# EAGLE design Rocket (EAGLE 9.6.2)

## Sheet 1 of 3
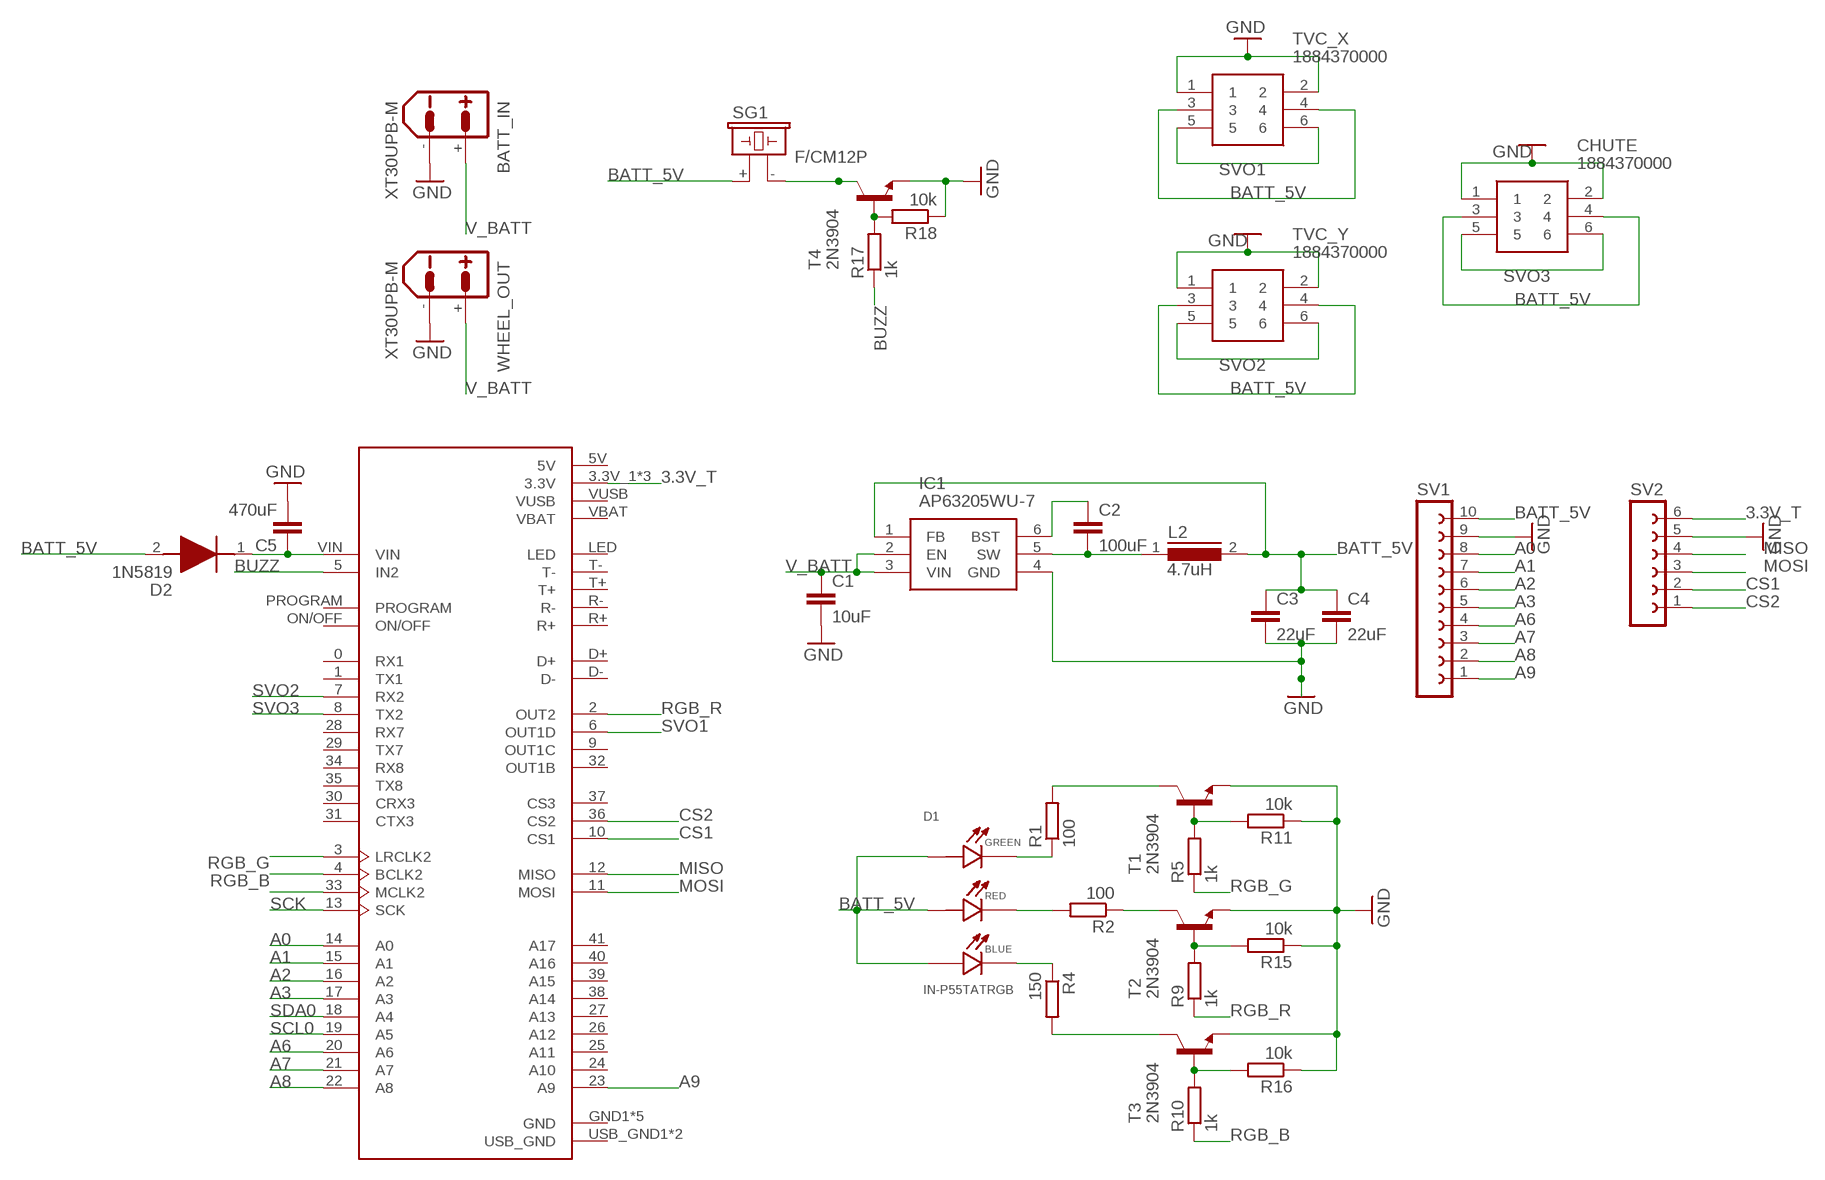
[diagram p0: schematic, sheet 1]

### Parts
BATT_IN  XT30UPB-M  [XT30UPB-M]
C1  10uF  C2.5/2  [C2.5-2]
C2  100uF  C2.5/2  [C2.5-2]
C3  22uF  C2.5/2  [C2.5-2]
C4  22uF  C2.5/2  [C2.5-2]
C5  470uF  C2.5/2  [C2.5-2]
CHUTE  1884370000  [1884370000]
D1  IN-P55TATRGB  [LED_IN-P55TATRGB]
D2  1N5819  [DIOAD1414W86L464D238]
IC1  AP63205WU-7  [AP63205WU7]
L2  4.7uH  MCC10  [MCC10]
R1  100  R-EU_0204/7  [0204/7]
R2  100  R-EU_0204/7  [0204/7]
R4  150  R-EU_0204/7  [0204/7]
R5  1k  R-EU_0204/7  [0204/7]
R9  1k  R-EU_0204/7  [0204/7]
R10  1k  R-EU_0204/7  [0204/7]
R11  10k  R-EU_0204/7  [0204/7]
R15  10k  R-EU_0204/7  [0204/7]
R16  10k  R-EU_0204/7  [0204/7]
R17  1k  R-EU_0204/7  [0204/7]
R18  10k  R-EU_0204/7  [0204/7]
SG1  F/CM12P  [F/CM12P]
SV1  FE10-1  [FE10]
SV2  FE06-1  [FE06]
T1  2N3904  [TO92]
T2  2N3904  [TO92]
T3  2N3904  [TO92]
T4  2N3904  [TO92]
TVC_X  1884370000  [1884370000]
TVC_Y  1884370000  [1884370000]
U6  DEV-16771  [MODULE_DEV-16771]
WHEEL_OUT  XT30UPB-M  [XT30UPB-M]

### Nets
3.3V_T: SV2.6 U6.3.3V_1(3.3V) U6.3.3V_2(3.3V) U6.3.3V_3(3.3V) ; also sheet 2,3
A0 [Info]: SV1.8 U6.14(A0)
A1 [Info]: SV1.7 U6.15(A1)
A2 [Info]: SV1.6 U6.16(A2)
A3 [Info]: SV1.5 U6.17(A3)
A6 [Info]: SV1.4 U6.20(A6)
A7 [Info]: SV1.3 U6.21(A7)
A8 [Info]: SV1.2 U6.22(A8)
A9 [Info]: SV1.1 U6.23(A9)
BATT_5V: C3.1 C4.1 CHUTE.3 CHUTE.4 D1.4(G_A) D1.5(R_A) D1.6(B_A) D2.2(A) IC1.1(FB) L2.2 SG1.+ SV1.10 TVC_X.3 TVC_X.4 TVC_Y.3 TVC_Y.4
BUZZ [Info]: R17.1 U6.5(IN2)
CS1 [Info]: SV2.2 U6.10(CS1)
CS2 [Info]: SV2.1 U6.36(CS2)
GND: BATT_IN.- C1.2 C3.2 C4.2 C5.2 CHUTE.1 CHUTE.2 IC1.4(GND) R11.1 R15.1 R16.1 R18.1 SV1.9 SV2.5 T1.3(E) T2.3(E) T3.3(E) T4.3(E) TVC_X.1 TVC_X.2 TVC_Y.1 TVC_Y.2 WHEEL_OUT.- ; also sheet 2,3
MISO [Info]: SV2.4 U6.12(MISO)
MOSI [Info]: SV2.3 U6.11(MOSI)
N$1 [Info]: D1.3(G_C) R1.1
N$2 [Info]: U6.33(MCLK2)
N$3 [Info]: D1.2(R_C) R2.2
N$4: C5.1 D2.1(K) U6.VIN
N$5 [Info]: D1.1(B_C) R4.1
N$6 [Info]: R1.2 T1.1(C)
N$7: C2.2 IC1.5(SW) L2.1
N$8: C2.1 IC1.6(BST)
N$11 [Info]: R2.1 T2.1(C)
N$12 [Info]: R4.2 T3.1(C)
N$13 [Info]: R5.2 R11.2 T1.2(B)
N$14 [Info]: R9.2 R15.2 T2.2(B)
N$15 [Info]: R10.2 R16.2 T3.2(B)
N$16 [Info]: SG1.- T4.1(C)
N$17 [Info]: R17.2 R18.2 T4.2(B)
RGB_B [Info]: R10.1 U6.4(BCLK2)
RGB_G [Info]: R5.1 U6.3(LRCLK2)
RGB_R [Info]: R9.1 U6.2(OUT2)
SCK [Info]: U6.13(SCK)
SCL0 [Info]: U6.19(A5) ; also sheet 2,3
SDA0 [Info]: U6.18(A4) ; also sheet 2,3
SVO1 [Info]: TVC_X.5 TVC_X.6 U6.6(OUT1D)
SVO2 [Info]: TVC_Y.5 TVC_Y.6 U6.7(RX2)
SVO3 [Info]: CHUTE.5 CHUTE.6 U6.8(TX2)
V_BATT: BATT_IN.+ C1.1 IC1.2(EN) IC1.3(VIN) WHEEL_OUT.+
Unconnected: U6.0(RX1) U6.1(TX1) U6.9(OUT1C) U6.24(A10) U6.25(A11) U6.26(A12) U6.27(A13) U6.28(RX7) U6.29(TX7) U6.30(CRX3) U6.31(CTX3) U6.32(OUT1B) U6.34(RX8) U6.35(TX8) U6.37(CS3) U6.38(A14) U6.39(A15) U6.40(A16) U6.41(A17) U6.D+ U6.D- U6.LED U6.ON/OFF U6.PROGRAM U6.R+ U6.R- U6.T+ U6.T- U6.VBAT U6.VUSB

## Sheet 2 of 3
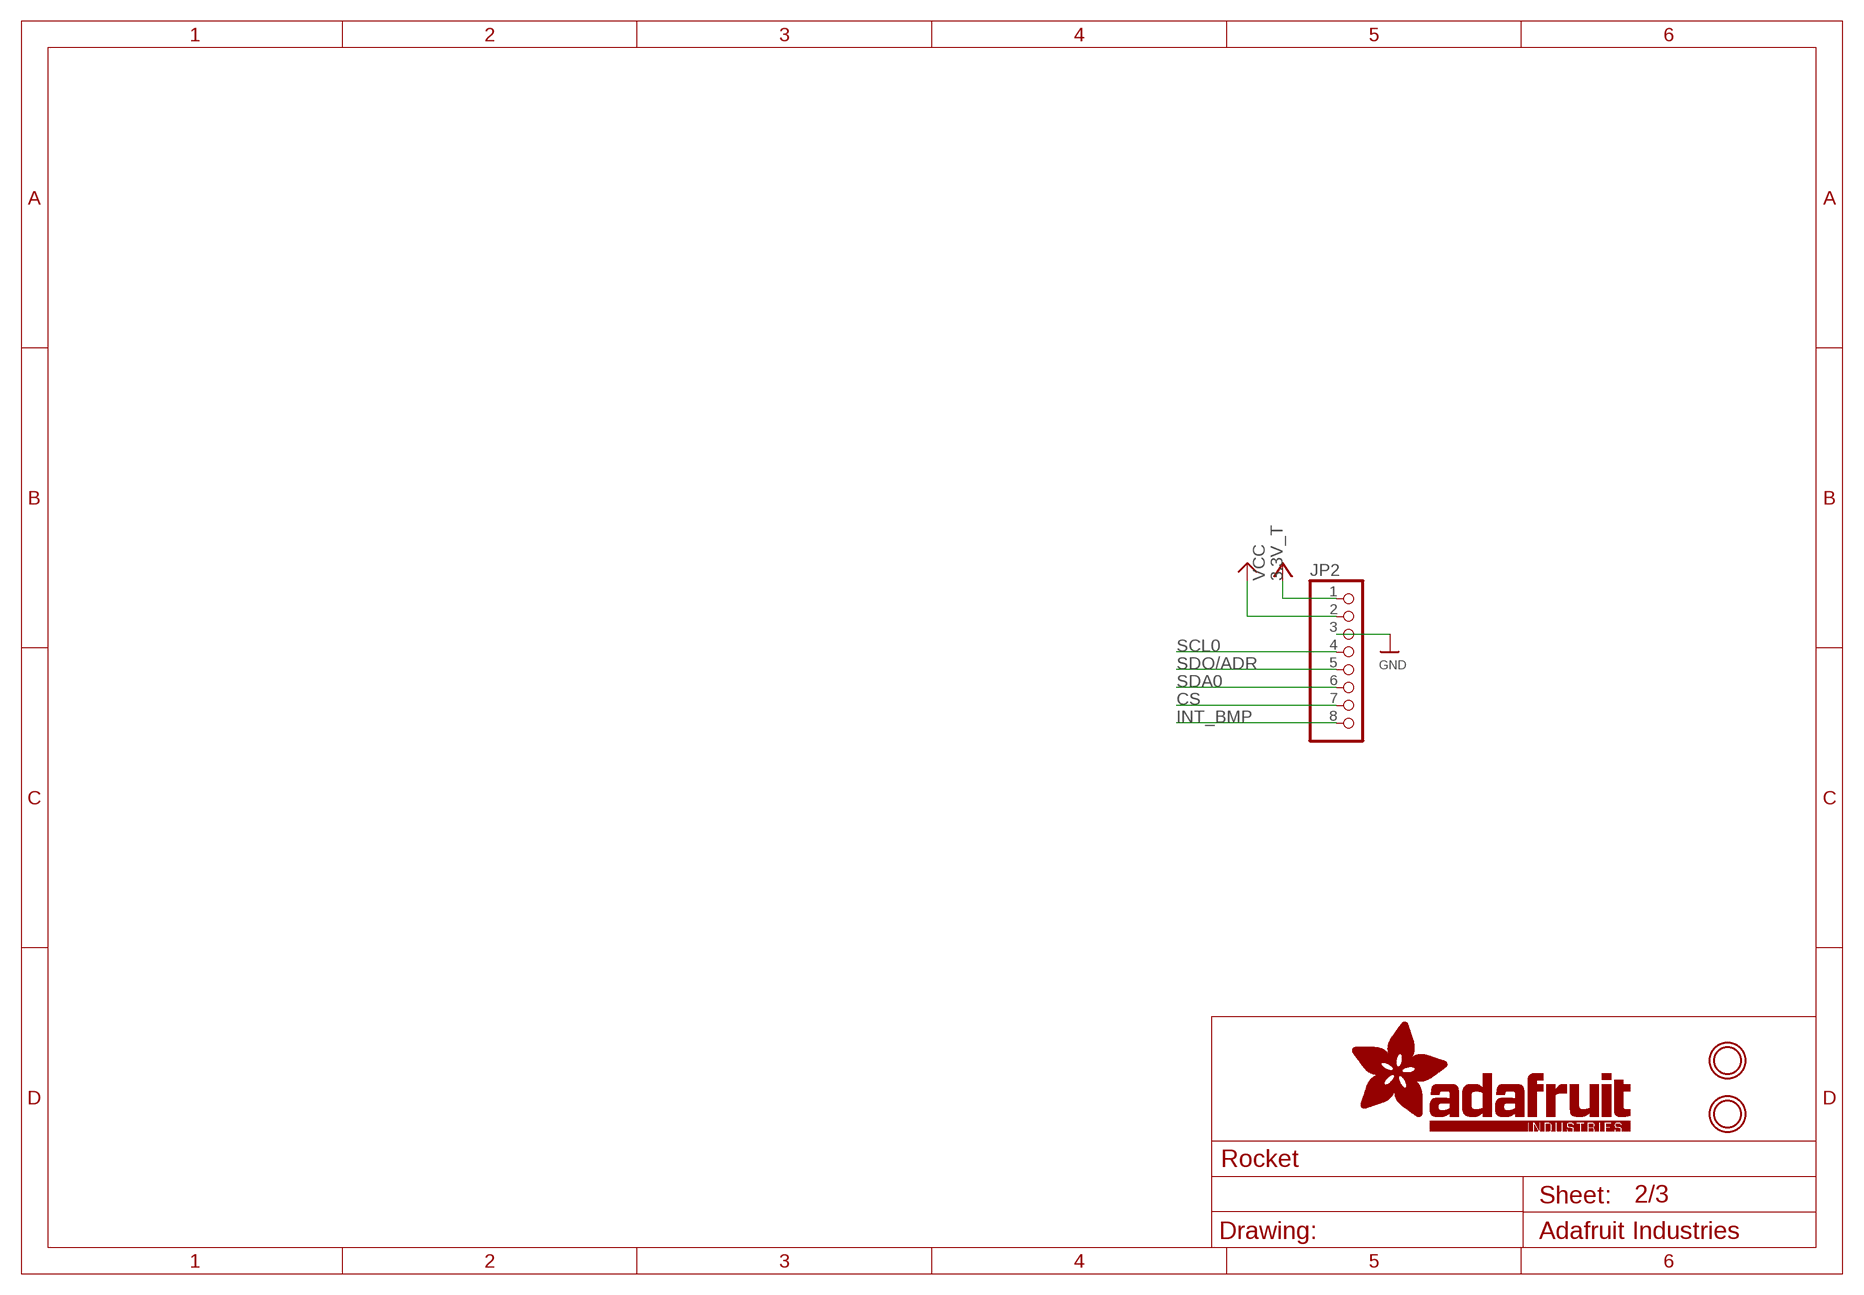
[diagram p1: schematic, sheet 2]

### Parts
JP2  HEADER-1X870MIL  [1X08_ROUND_70]
U$24  MOUNTINGHOLE2.5  [MOUNTINGHOLE_2.5_PLATED]
U$26  MOUNTINGHOLE2.5  [MOUNTINGHOLE_2.5_PLATED]

### Nets
3.3V_BMP: JP2.2 ; supply symbol labelled 3.3V
3.3V_T: JP2.1 ; supply symbol labelled VCC ; also sheet 1,3
CS [Info]: JP2.7
GND: JP2.3 ; also sheet 1,3
INT_BMP [Info]: JP2.8
SCL0 [Info]: JP2.4 ; also sheet 1,3
SDA0 [Info]: JP2.6 ; also sheet 1,3
SDO/ADR [Info]: JP2.5

## Sheet 3 of 3
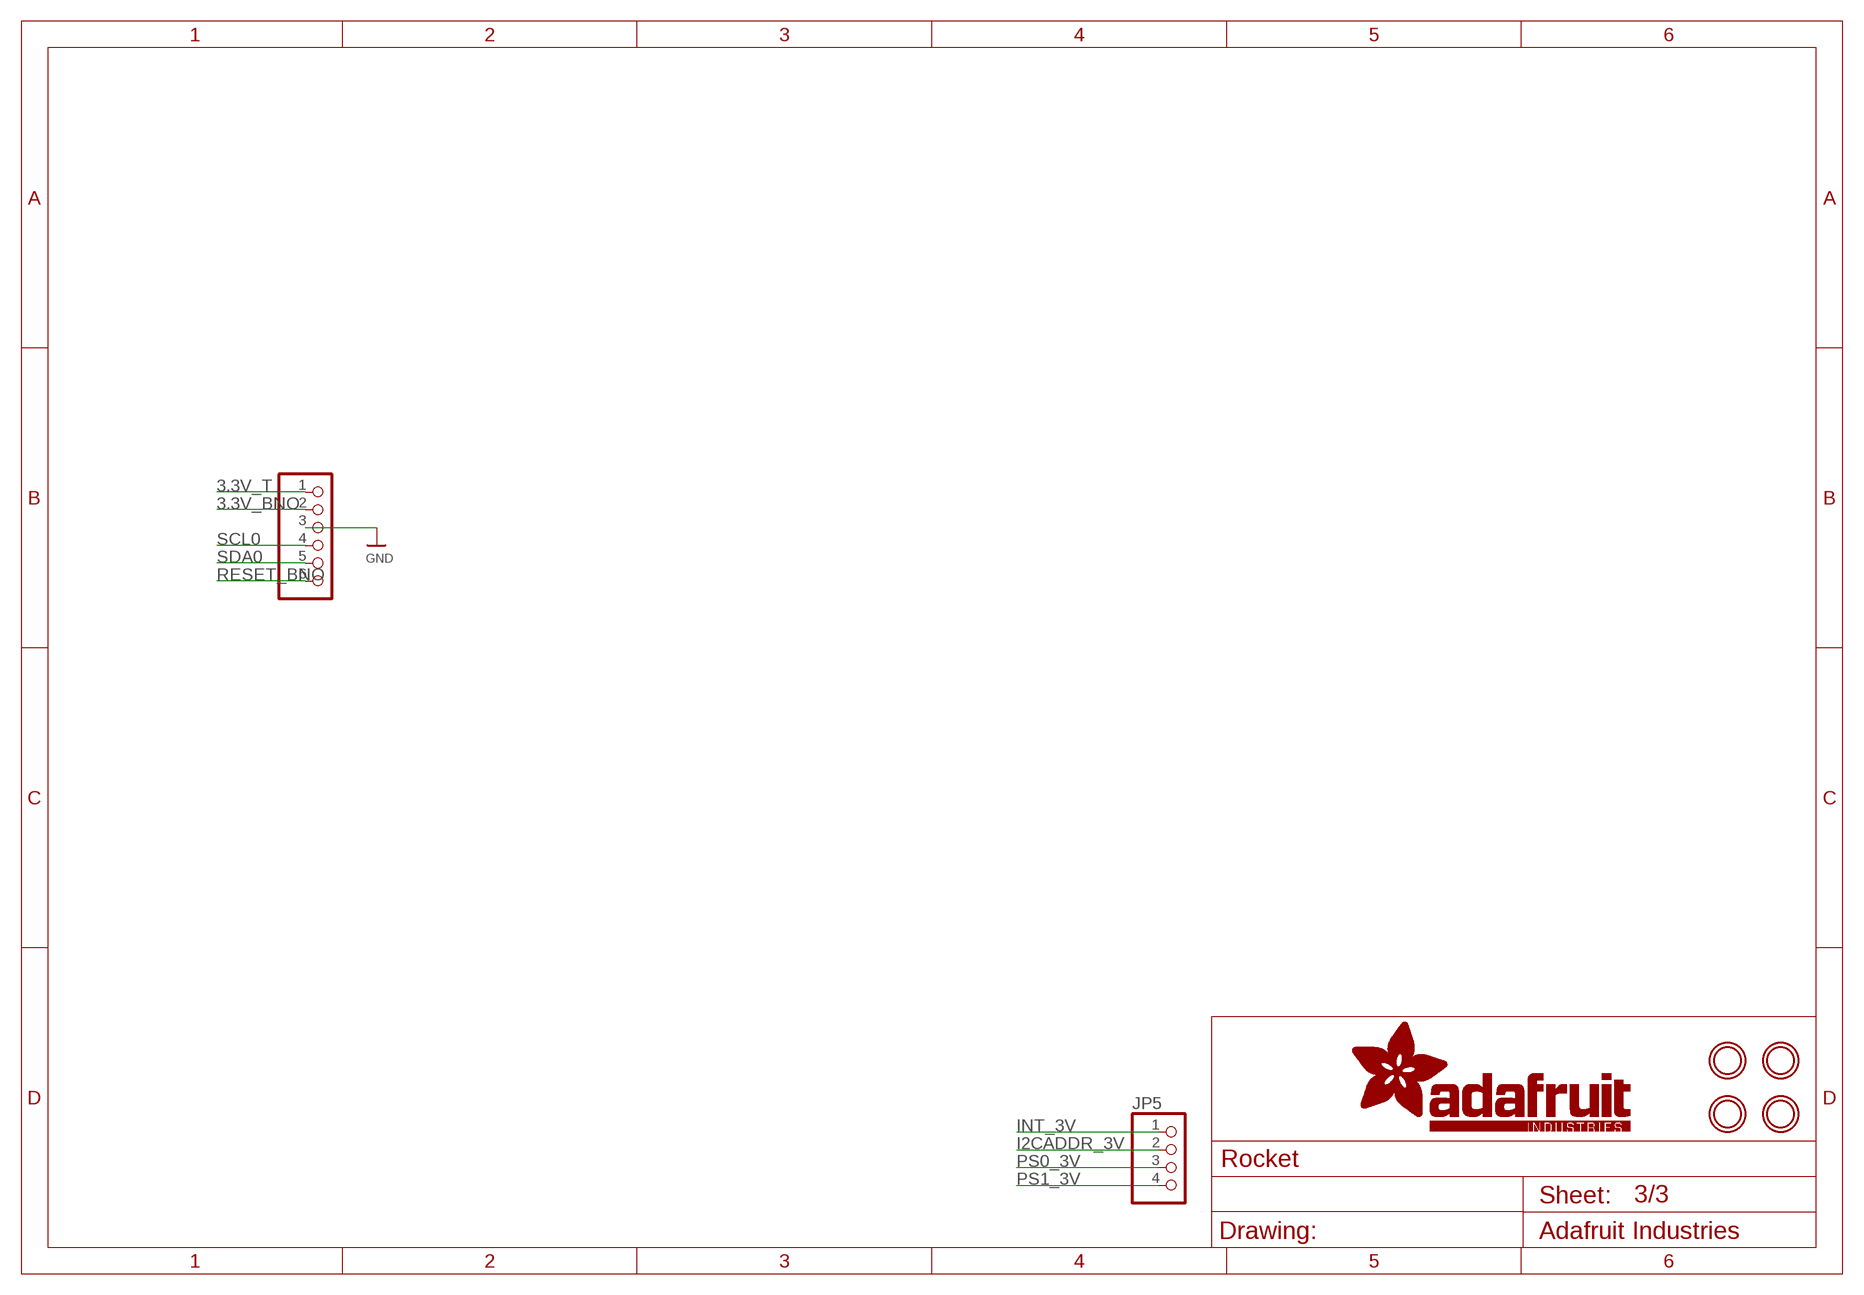
[diagram p2: schematic, sheet 3]

### Parts
JP5  HEADER-1X476MIL  [1X04_ROUND_76]
JP6  HEADER-1X670MIL  [1X06_ROUND_70]
U$109  MOUNTINGHOLE2.5  [MOUNTINGHOLE_2.5_PLATED]
U$110  MOUNTINGHOLE2.5  [MOUNTINGHOLE_2.5_PLATED]
U$112  MOUNTINGHOLE2.5  [MOUNTINGHOLE_2.5_PLATED]
U$113  MOUNTINGHOLE2.5  [MOUNTINGHOLE_2.5_PLATED]

### Nets
3.3V_BNO: JP6.2
3.3V_T: JP6.1 ; also sheet 1,2
GND: JP6.3 ; also sheet 1,2
I2CADDR_3V: JP5.2
INT_3V: JP5.1
PS0_3V: JP5.3
PS1_3V: JP5.4
RESET_BNO [Info]: JP6.6
SCL0 [Info]: JP6.4 ; also sheet 1,2
SDA0 [Info]: JP6.5 ; also sheet 1,2

## Power pins joined to a net without a drawn wire
5V: U6.5V
GND: U6.GND1(GND) U6.GND2(GND) U6.GND3(GND) U6.GND4(GND) U6.GND5(GND)
USB_GND: U6.USB_GND1(USB_GND) U6.USB_GND2(USB_GND)

## Library data of the parts
BATT_IN WHEEL_OUT = amass:XT30: AMASS XT30 connector Store in Japan AMASS XT30 connector <https://szc.jp/ams-xt30>
C1-C5 = capacitor-wima:C: CAPACITOR naming: grid - package width
CHUTE TVC_X TVC_Y = 1884370000:1884370000: Printed circuit board terminals, 5.00 mm, Number of poles: 3, 135, Solder pin length: 3.5 mm, black, PUSH IN with actuator, Clamping range, max. [rated connection]: 1.5 mm, Tube Source: Datasheet <http://catalog.weidmueller.com/createDatasheetForMobile.do?ordernumber=1884370000&scope1=1&scope2=1&localeId=en>; DESCRIPTION: Printed circuit board terminals, 5.00 mm, Number of poles: 3, 135, Solder pin length: 3.5 mm, black, PUSH IN with actuator, Clamping range, max. [rated connection]: 1.5 mm, Tube; HEIGHT: 12.9mm; MANUFACTURER_NAME: Weidmuller; MANUFACTURER_PART_NUMBER: 1884370000; MOUSER_PART_NUMBER: 470-1884370000; MOUSER_PRICE-STOCK: https://www.mouser.co.uk/ProductDetail/Weidmuller/1884370000?qs=WJDKaGZ8K%252B5QFyaaEcXT4A%3D%3D
D1 = IN-P55TATRGB:IN-P55TATRGB: Check availability <https://pricing.snapeda.com/parts/IN-P55TATRGB/Inolux/view-part?ref=eda>; AVAILABILITY: In Stock; CHECK_PRICES: https://www.snapeda.com/parts/IN-P55TATRGB/Inolux/view-part/?ref=eda; DESCRIPTION: Red, Green, Blue (RGB) 624nm Red, 520nm Green, 468nm Blue LED Indication - Discrete 2V Red, 3.2V Green, 3.2V Blue 6-SMD, J-Lead; MF: Inolux; MP: IN-P55TATRGB; PACKAGE: SMD-6 Inolux; PRICE: None; SNAPEDA_LINK: https://www.snapeda.com/parts/IN-P55TATRGB/Inolux/view-part/?ref=snap
D2 = 1N5819:1N5819: Schottky barrier diode,1N58191A 40V STMicroelectronics 1N5819, Schottky Diode, 40V 1A, 2-Pin DO-204AL Source: Datasheet <http://www.st.com/web/en/resource/technical/document/datasheet/CD00001625.pdf>; DESCRIPTION: Schottky barrier diode,1N58191A 40V STMicroelectronics 1N5819, Schottky Diode, 40V 1A, 2-Pin DO-204AL; HEIGHT: mm; MANUFACTURER_NAME: STMicroelectronics; MANUFACTURER_PART_NUMBER: 1N5819; MOUSER_PART_NUMBER: 511-1N5819; MOUSER_PRICE-STOCK: https://www.mouser.co.uk/ProductDetail/STMicroelectronics/1N5819?qs=G5AQjGfRJcKKUy9S%252BaTHRQ%3D%3D
IC1 = AP63205WU-7:AP63205WU-7: Buck Switching Regulator IC Positive Fixed 5V 1 Output 2A SOT-23-6 Thin, TSOT-23-6 Source: Datasheet <https://www.diodes.com//assets/Datasheets/AP63200-AP63201-AP63203-AP63205.pdf>; DESCRIPTION: Buck Switching Regulator IC Positive Fixed 5V 1 Output 2A SOT-23-6 Thin, TSOT-23-6; HEIGHT: 1mm; MANUFACTURER_NAME: Diodes Incorporated; MANUFACTURER_PART_NUMBER: AP63205WU-7; MOUSER_PART_NUMBER: 621-AP63205WU-7; MOUSER_PRICE-STOCK: https://www.mouser.co.uk/ProductDetail/Diodes-Incorporated/AP63205WU-7?qs=u16ybLDytRZtkj8PzdWCOw%3D%3D
JP2 = microbuilder:HEADER-1X8: PIN HEADER
JP5 = microbuilder:HEADER-1X4: PIN HEADER
JP6 = microbuilder:HEADER-1X6: PIN HEADER
L2 = inductors:MCC10: INDUCTOR; SPICEPREFIX: L
R1 R2 R4 R5 R9-R11 R15-R18 = rcl:R-EU_: RESISTOR, European symbol; SPICEPREFIX: R
SG1 = buzzer:F/CM12P: BUZZER Source: Buerklin; OC_FARNELL: unknown; OC_NEWARK: unknown
SV1 = con-lsta:FE10-1: FEMALE HEADER; OC_FARNELL: unknown; OC_NEWARK: unknown
SV2 = con-lsta:FE06-1: FEMALE HEADER; OC_FARNELL: unknown; OC_NEWARK: unknown
T1-T4 = transistor:2N3904: NPN TRANSISTOR
U6 = Teensy_4.1:DEV-16771: Check availability <https://pricing.snapeda.com/parts/DEV-16771/SparkFun%20Electronics/view-part?ref=eda>; AVAILABILITY: In Stock; CHECK_PRICES: https://www.snapeda.com/parts/DEV-16771/SparkFun/view-part/?ref=eda; DESCRIPTION: RT1062 Teensy 4.1 series ARM® Cortex®-M7 MPU Embedded Evaluation Board; MF: SparkFun Electronics; MP: DEV-16771; PACKAGE: None; PRICE: None; SNAPEDA_LINK: https://www.snapeda.com/parts/DEV-16771/SparkFun/view-part/?ref=snap
U$24 U$26 U$109 U$110 U$112 U$113 = microbuilder:MOUNTINGHOLE: Mounting Hole For #2 screws (0.086"/2.18mm width, 0.094"/2.4mm hole) use 2.5mm; BOM: EXCLUDE

## Net classes
1 highpower: width 0.406 mm, drill 0.483 mm
2 Info: width 0.3 mm, drill 0.3 mm, clearance 0.2 mm

## Board
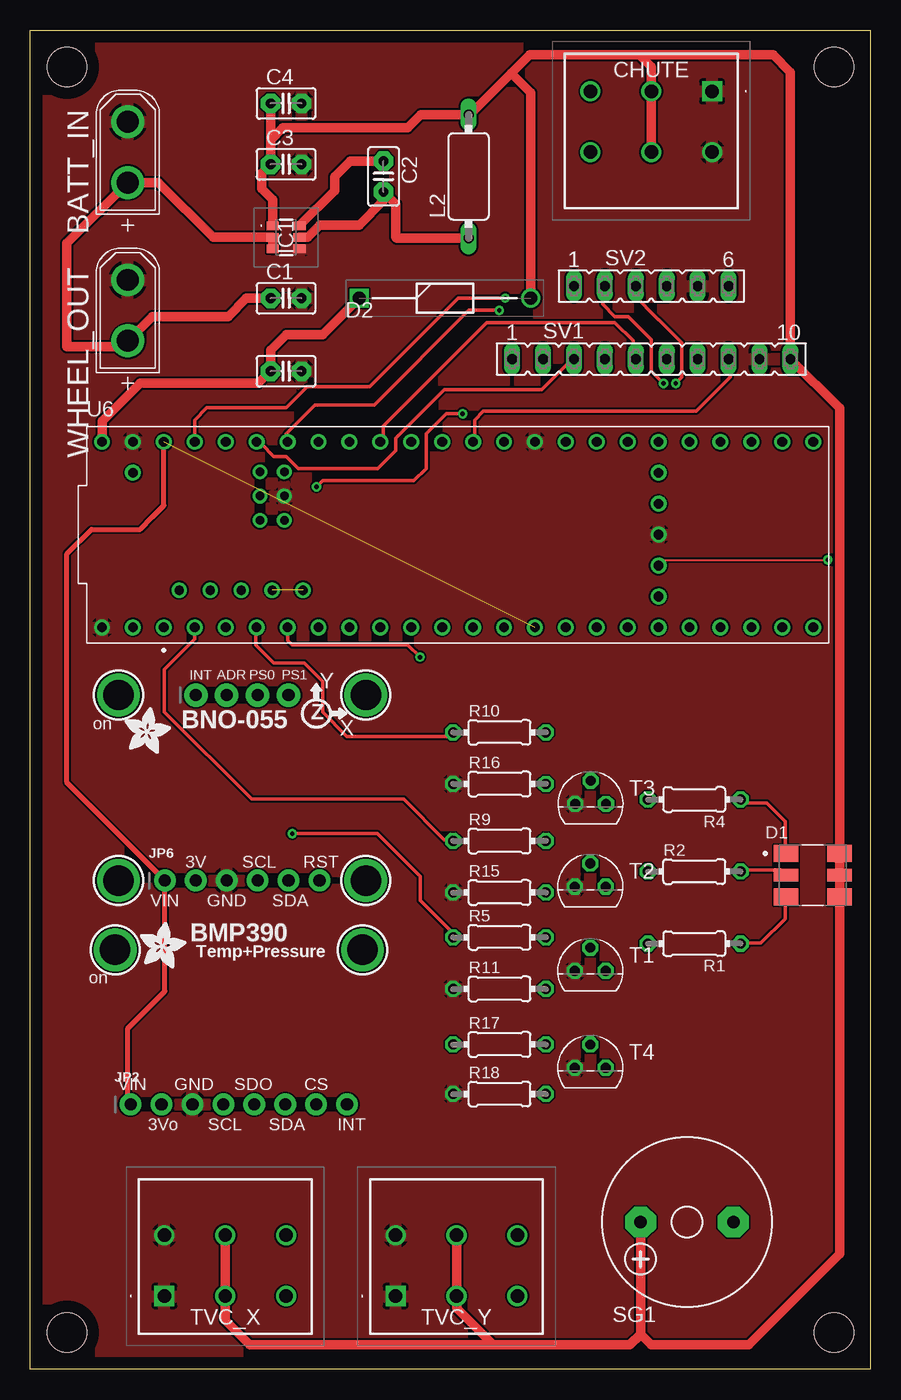
[diagram p3: board, top side]
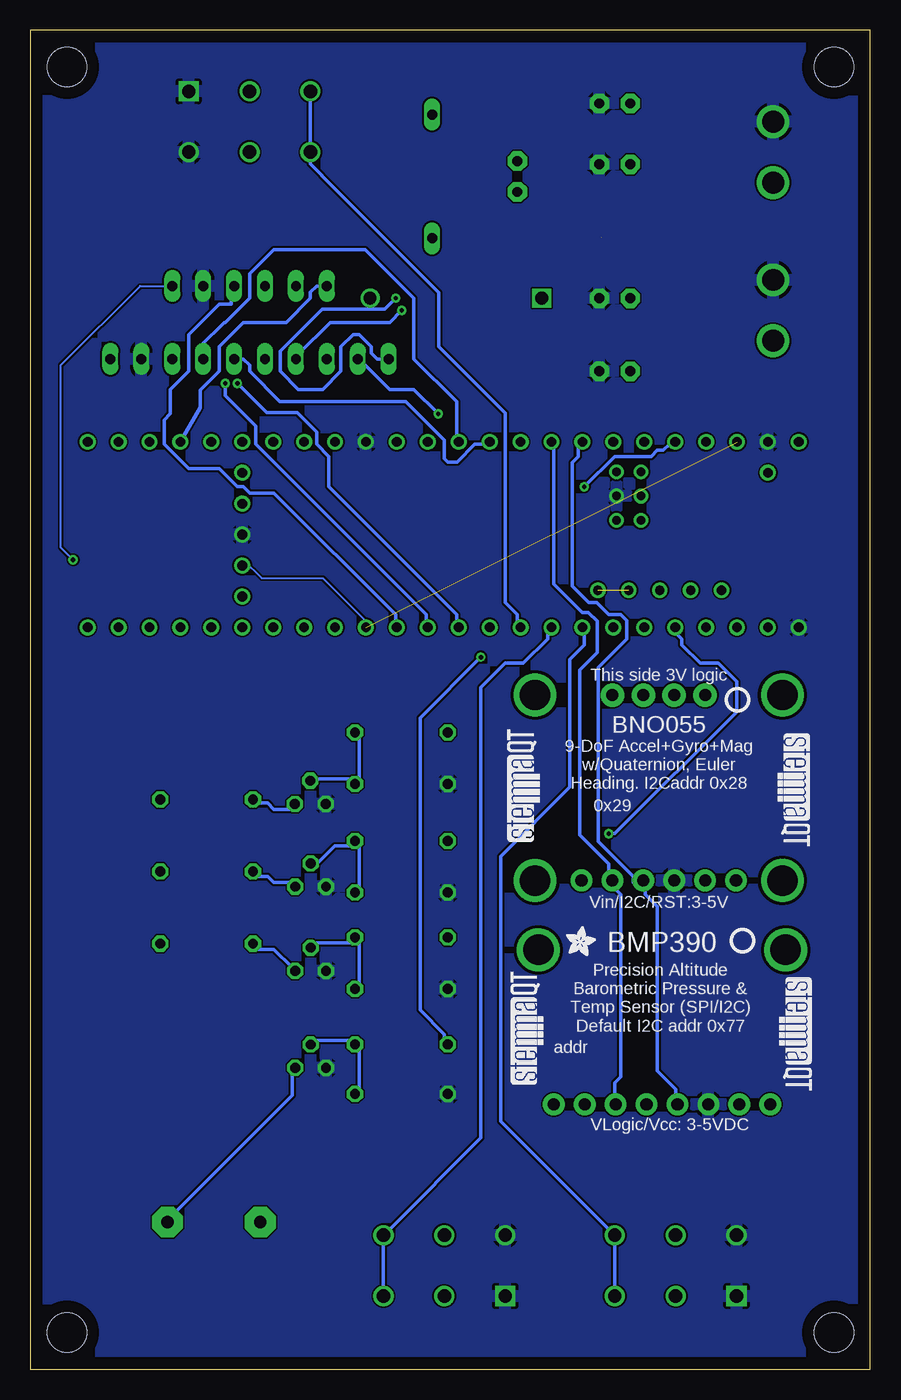
[diagram p4: board, bottom side, seen from below]

Size 69 x 110 mm. Coordinates in mm from the lower left corner, seen from the top.
Outline: 0,110 69,110 69,0 0,0 0,110
Copper layers (1*16): Top 0.035mm / dielectric 1.5mm / Bottom 0.035mm
Design rules "default": minimum track width 6mil, minimum drill 0.35mm, track to track 6mil, track to pad 6mil, pad to pad 6mil, via to via 6mil, smd to smd 6mil, copper to edge 40mil, drill to drill 6mil, minimum pad ring 10mil, minimum via ring 8mil, stop-mask expansion 4mil, vias tented up to drill 0mil, thermal gap 10mil
Holes 3.2 mm at 3,107 66,107 3,3 66,3

### Footprints (pad centres in the part's own frame; a part is rotated, then mirrored left to right if it is on the bottom)
XT30UPB-M = drill 1.8: + 2.5,0; - -2.5,0
C2.5-2 = drill 0.813 pad 1.6 octagon: 1 -1.27,0; 2 1.27,0
1884370000 = drill 1.1 pad 1.65 square: 1 0,0 | drill 1.1 pad 1.65: 2 0,5; 3 5,0; 4 5,5; 5 10,0; 6 10,5
LED_IN-P55TATRGB = smd 2 x 1.4: 1 -2.2,1.8; 3 -2.2,-1.8; 4 2.2,-1.8; 6 2.2,1.8 | smd 2 x 1: 2 -2.2,0; 5 2.2,0
DIOAD1414W86L464D238 = drill 1.05 pad 1.575 square: 1 0,0 | drill 1.05 pad 1.575: 2 14.1,0
AP63205WU7 = smd 0.7 x 1: 1 -0.95,-1.099; 2 0,-1.099; 3 0.95,-1.099; 4 0.95,1.099; 5 0,1.099; 6 -0.95,1.099
1X08_ROUND_70 = drill 1 pad 1.778: 1 -8.89,0; 2 -6.35,0; 3 -3.81,0; 4 -1.27,0; 5 1.27,0; 6 3.81,0; 7 6.35,0; 8 8.89,0
1X04_ROUND_76 = drill 1 pad 1.93: 1 -3.81,0; 2 -1.27,0; 3 1.27,0; 4 3.81,0
1X06_ROUND_70 = drill 1 pad 1.778: 1 -6.35,0; 2 -3.81,0; 3 -1.27,0; 4 1.27,0; 5 3.81,0; 6 6.35,0
MCC10 = drill 0.813 long: 1 -5.08,0; 2 5.08,0
0204/7 = drill 0.813 octagon: 1 -3.81,0; 2 3.81,0
F/CM12P = drill 1.016 pad 2.54 octagon: + 3.81,0; - -3.81,0
FE10 = drill 0.813 long: 1 -11.43,0; 2 -8.89,0; 3 -6.35,0; 4 -3.81,0; 5 -1.27,0; 6 1.27,0; 7 3.81,0; 8 6.35,0; 9 8.89,0; 10 11.43,0
FE06 = drill 0.813 long: 1 -6.35,0; 2 -3.81,0; 3 -1.27,0; 4 1.27,0; 5 3.81,0; 6 6.35,0
TO92 = drill 0.813 octagon: 1 1.27,0; 2 0,1.905; 3 -1.27,0
MODULE_DEV-16771 = drill 0.8: 0 -26.67,-7.62; 1 -24.13,-7.62; 2 -21.59,-7.62; 3 -19.05,-7.62; 3.3V_1 6.35,-7.62; 3.3V_2 -24.13,7.62; 3.3V_3 16.51,-2.54; 4 -16.51,-7.62; 5 -13.97,-7.62; 6 -11.43,-7.62; 7 -8.89,-7.62; 8 -6.35,-7.62; 9 -3.81,-7.62; 10 -1.27,-7.62; 11 1.27,-7.62; 12 3.81,-7.62; 13 3.81,7.62; 14 1.27,7.62; 15 -1.27,7.62; 16 -3.81,7.62; 17 -6.35,7.62; 18 -8.89,7.62; 19 -11.43,7.62; 20 -13.97,7.62; 21 -16.51,7.62; 22 -19.05,7.62; 23 -21.59,7.62; 24 8.89,-7.62; 25 11.43,-7.62; 26 13.97,-7.62; 27 16.51,-7.62; 28 19.05,-7.62; 29 21.59,-7.62; 30 24.13,-7.62; 31 26.67,-7.62; 32 29.21,-7.62; 33 29.21,7.62; 34 26.67,7.62; 35 24.13,7.62; 36 21.59,7.62; 37 19.05,7.62; 38 16.51,7.62; 39 13.97,7.62; 40 11.43,7.62; 41 8.89,7.62; GND1 -29.21,-7.62; GND2 6.35,7.62; GND3 -26.67,7.62; GND4 16.51,0; ON/OFF 16.51,5.08; PROGRAM 16.51,2.54; VBAT 16.51,-5.08; VIN -29.21,7.62; VUSB -26.67,5.08 | drill 0.75: 5V -22.86,-4.57; D+ -17.78,-4.57; D- -20.32,-4.57; USB_GND1 -15.24,-4.57; USB_GND2 -12.7,-4.57 | drill 0.7: GND5 -14.24,3.17; LED -16.24,3.17; R+ -16.24,5.17; R- -14.24,5.17; T+ -14.24,1.17; T- -16.24,1.17
MOUNTINGHOLE_2.5_PLATED = drill 2.5 pad 3.2: P$1 0,0

### Placement (x,y rotation side)
BATT_IN  8,100 270 top
C1  21,88 0 top
C2  29,98 270 top
C3  21,99 0 top
C4  21,104 0 top
C5  21,82 0 top
CHUTE  56,105 180 top
D1  64.26,40.58 0 top
D2  27,88 0 top
IC1  21,93 270 top
JP2  17.12,21.75 0 top
JP5  17.39,55.39 0 top
JP6  17.39,40.15 0 top
L2  36,98 90 top
R1  54.53,34.96 180 top
R2  54.53,40.88 0 top
R4  54.53,46.8 180 top
R5  38.53,35.48 0 top
R9  38.53,43.4 0 top
R10  38.53,52.32 0 top
R11  38.53,31.24 0 top
R15  38.53,39.16 0 top
R16  38.53,48.08 0 top
R17  38.53,26.68 0 top
R18  38.53,22.6 0 top
SG1  53.93,12.08 180 top
SV1  51,83 0 top
SV2  51,89 0 top
T1  45.99,32.72 0 top
T2  45.99,39.64 0 top
T3  46.01,46.44 0 top
T4  45.99,24.76 0 top
TVC_X  11,6 0 top
TVC_Y  30,6 0 top
U6  35.09,68.57 0 top
U$24  6.96,34.45 0 top
U$26  27.28,34.45 0 top
U$32  [ADAFRUIT_2.5MM]  24.99,33.94 0 bottom
U$39  [ADAFRUIT_3.5MM]  8.99,32.93 0 top
U$43  [PCBFEAT-REV-040]  10.52,35.21 0 bottom
U$44  [STEMMAQT]  26.9,23.4 90 bottom
U$50  [STEMMAQT]  7.47,32.16 270 bottom
U$109  7.23,55.39 0 top
U$110  27.55,55.39 0 top
U$112  7.23,40.15 0 top
U$113  27.55,40.15 0 top
U$117  [ADAFRUIT_3.5MM]  7.74,50.56 0 top
U$118  [PCBFEAT-REV-040]  10.91,55.01 0 bottom
U$119  [STEMMAQT]  27.17,43.33 90 bottom
U$120  [STEMMAQT]  7.61,52.22 270 bottom
WHEEL_OUT  8,87 270 top

### Tracks (layer width: path | path; a pad name or v marks a point on that pad's centre or on a via)
3.3V_T  (via drill 0.35)  (1 unrouted)
  Top 0.152: v65.5,66.5 52,66.5 U6.3.3V_3
  Top 0.4: JP2.1 8,21.98 8,28 11.04,31.04 JP6.1 3,48.19 3,67 5,69 9,69 10,70 10.96,70.96 U6.3.3V_2
  Bottom 0.152: U6.3.3V_1 41.5,61 41.5,61.5 45,65 50,65 51.5,66.5 U6.3.3V_3 | SV2.6 60,89 66.5,82.5 66.5,67.5 v65.5,66.5
A0
  Top 0.3: U6.14 36.5,76.5 36.5,78 37.2,78.7 54.7,78.7 57.5,81.5 57.5,83 SV1.8
A1
  Bottom 0.3: U6.15 34,76.5 34,79.5 37.5,83 37.5,88 41.5,92 49,92 51,90 51,88 53,86 53.09,86 55,84.09 55,83 SV1.7
A2
  Bottom 0.3: SV1.6 51.5,83 51,82.5 51,82 48.52,79.52 38.17,79.52 35,76.35 35,74.81 34.73,74.54 33.96,74.54 32.5,76 31.5,76 U6.16
A3
  Top 0.3: U6.17 29,76.5 29,77.5 37.5,86 48,86 49.5,84.5 49.5,83 SV1.5
A6  (via drill 0.35)
  Top 0.3: v38.5,87 36,87 28.22,79.22 23.36,79.22 21,76.86 21,76.5 U6.20
  Bottom 0.3: v38.5,87 39.5,86 44.38,86 47,83.38 47,83 SV1.4
A7
  Top 0.3: U6.21 19,76 20,75 21,75 22,74 28.53,74 30,75.47 30,76.5 34,80.5 42,80.5 44.5,83 SV1.3
A8  (via drill 0.35)
  Top 0.3: v23.5,72.5 24,73 31.5,73 32.5,74 32.5,76.86 34.14,78.5 v35.5,78.5
  Bottom 0.3: v23.5,72.5 21,75 18,75 17.5,75.5 17,75.5 16.5,76 U6.22 | v35.5,78.5 37.5,80.5 39.5,80.5 42,83 SV1.2
A9  (via drill 0.35)
  Top 0.3: U6.23 13.5,78 14.5,79 21,79 22.74,80.74 27.87,80.74 35.14,88 v39,88
  Bottom 0.3: v39,88 39.89,87.11 45.03,87.11 48.5,83.64 48.5,82 47,80.5 45,80.5 43.5,82 43.5,84 42.5,85 42,85 41,84 41,83.5 40.5,83 SV1.1
BATT_5V
  Top 0.8: IC1.1 19.9,96.1 19,97 19,98.27 C3.1 19.73,101 | 19.73,101 C4.1 | 19.73,101 20.73,102 31,102 32.08,103.08 L2.2 36.08,103.08 39.5,106.5 | 39.5,106.5 41,108 50,108 | 50,108 51,107 CHUTE.3 CHUTE.4 | 50,108 61,108 62.43,106.57 SV1.10 66.46,78.97 D1.6 | D1.6 D1.5 D1.4 | D1.6 66.46,9.46 59,2 51,2 50.12,2.88 | SG1.+ 50.12,2.88 | 50.12,2.88 49.24,2 38,2 | 38,2 35,5 TVC_Y.3 TVC_Y.4 | 38,2 18,2 16,4 TVC_X.3 TVC_X.4 | 39.5,106.5 41.1,104.9 D2.2
BUZZ  (via drill 0.35)
  Top 0.3: v32,58.5 31,59.5 21.5,59.5 21.12,59.88 U6.5
  Bottom 0.3: v32,58.5 37,53.5 37,29.5 35,27.5 35,27 R17.1
CS1  (via drill 0.35)
  Top 0.3: v52,81 51,82 51,84.61 49.11,86.5 48,86.5 47,87.5 47,89 SV2.2
  Bottom 0.3: v52,81 49.59,78.59 47.09,78.59 45.5,77 45.5,76 44.5,75 44.5,72.5 34,62 34,61 U6.10
CS2
  Bottom 0.3: SV2.1 45.5,89 46,88.5 46,88 48,86 51.5,86 53.5,84 53.5,82 55.05,80.45 55.05,78.99 U6.36
GND
  pour Top: 0,110 69,110 69,0 0,0
  pour Bottom: 0,110 69,110 69,0 0,0
MISO
  Bottom 0.3: U6.12 39,61 39,62 49,72 51,72 51.5,72.5 52,72.5 53.5,74 56,74 58,76 58,78 57.5,78.5 57.5,80.5 56,82 56,85 53.5,87.5 52.5,87.5 52.5,89 SV2.4
MOSI  (via drill 0.35)
  Top 0.3: v53,81 53.5,81.5 53.5,84.35 51.62,86.23 51.58,86.23 49.5,88.31 49.5,89 SV2.3
  Bottom 0.3: v53,81 53,80 50.5,77.5 50.5,76 36.5,62 36.5,61 U6.11
N$1
  Top 0.3: D1.3 62,38.5 62,37 60,35 58.5,35 R1.1
N$3
  Top 0.3: D1.2 61.64,41 58.46,41 R2.2
N$4
  Top 0.8: D2.1 24,85 21,85 19.73,83.73 C5.1 18.73,81 9,81 5.88,77.88 U6.VIN
N$5
  Top 0.3: D1.1 62,42.5 62,45 60.5,46.5 58.5,46.5 R4.1
N$6
  Bottom 0.3: T1.1 47.5,33 49,34.5 50.5,34.5 R1.2
N$7  (1 unrouted)
  Top 0.8: L2.1 30.08,92.92 30,93 30,95.73 C2.2 29,96 27,94 23.78,94 22.78,93 IC1.5
N$8
  Top 0.8: IC1.6 25,96.85 25,98 26.27,99.27 C2.1
N$11
  Bottom 0.3: T2.1 47.5,40 49,40 49.5,40.5 50.5,40.5 R2.1
N$12
  Bottom 0.3: T3.1 47.5,46 49,46 49.5,46.5 50.5,46.5 R4.2
N$13
  Bottom 0.3: R11.2 42,31.5 42,35 R5.2 42.5,35 45.5,35 T1.2
N$14
  Bottom 0.3: R15.2 42,39.5 42,43 R9.2 42.5,43 44,43 45.5,41.5 T2.2
N$15
  Bottom 0.3: R10.2 42,52 42,48.5 R16.2 42.5,48.5 46,48.5 T3.2
N$16
  Bottom 0.3: T4.1 47.5,24.5 47.5,22.5 57,13 57.5,13 57.5,12.5 SG1.-
N$17
  Bottom 0.3: R18.2 42,23 42,26.5 R17.2 42.5,27 45.5,27 T4.2
RGB_B
  Top 0.3: U6.4 18.5,60.5 18.5,59.5 20,58 22.5,58 24,56.5 24,54 26,52 34.5,52 R10.1
RGB_G  (via drill 0.35)
  Top 0.3: v21.5,44 28.5,44 32,40.5 32,38.5 35,35.5 R5.1
  Bottom 0.3: v21.5,44 21,44 11,54 11,56.5 12.5,58 14,58 15.5,59.5 15.5,60 16,60.5 U6.3
RGB_R
  Top 0.3: U6.2 13.5,60 11,57.5 11,54 18.17,46.83 30.67,46.83 34,43.5 34.5,43.5 R9.1
SCL0
  Bottom 0.3: U6.19 24,76 24,75 24.5,74.5 24.5,64.35 23.15,63 22.5,63 21.5,62 20.5,62 20,61.5 20,60 22.36,57.63 22.36,43.37 19.5,40.5 19.5,40 19,40 JP6.4 18.5,40 18.5,39 17.5,38 17.5,24.5 16,23 16,22 JP2.4
SDA0
  Bottom 0.3: U6.18 26,76 26,64.5 23.68,62.18 23.18,62.18 22.45,61.45 22.45,58.88 23.88,57.45 23.88,43.88 21.5,41.5 21.5,40.5 JP6.5 21,40 21,39.5 20.5,39 20.5,24 21,23.5 21,22 JP2.6
SVO1
  Bottom 0.3: U6.6 23.5,60.5 23.5,59.5 24.69,58.31 24.69,47.81 30.36,42.13 30.36,20.36 21.5,11.5 21,11.5 TVC_X.6 TVC_X.5
SVO2
  Bottom 0.3: U6.7 26.5,60.5 26.5,60 28.5,58 30,58 32,56 32,19 39.5,11.5 40,11.5 TVC_Y.6 TVC_Y.5
SVO3
  Bottom 0.3: U6.8 29,61 29,62 30,63 30,78.56 35.45,84.01 35.45,88.45 45.06,98.06 45.06,98.09 46,99.03 CHUTE.6 CHUTE.5
USB_GND  (1 unrouted)
V_BATT
  Top 0.8: C1.1 17.73,88 16.23,86.5 10,86.5 WHEEL_OUT.+ 7.5,84 3,84 3,92.5 BATT_IN.+ 10.5,97.5 15,93 IC1.2 IC1.3

### Text on the board
tPlace: INT | ADR | PS0 | PS1 | Y | on | BNO-055 | Z | X | 3V | SCL | RST | VIN | GND | SDA | BMP390 | Temp+Pressure | on | SDO | CS | VIN | GND | 3Vo | SCL | SDA | INT
bPlace: This side 3V logic | BNO055 | 9-DoF Accel+Gyro+Mag / w/Quaternion, Euler / Heading. I2Caddr 0x28 | 0x29 | Vin/I2C/RST:3-5V | BMP390 | Precision Altitude / Barometric Pressure & / Temp Sensor (SPI/I2C) / Default I2C addr 0x77 | addr | VLogic/Vcc: 3-5VDC